# Altium schematic sheet Muller-C2.SchDoc
size 419 x 208 mm
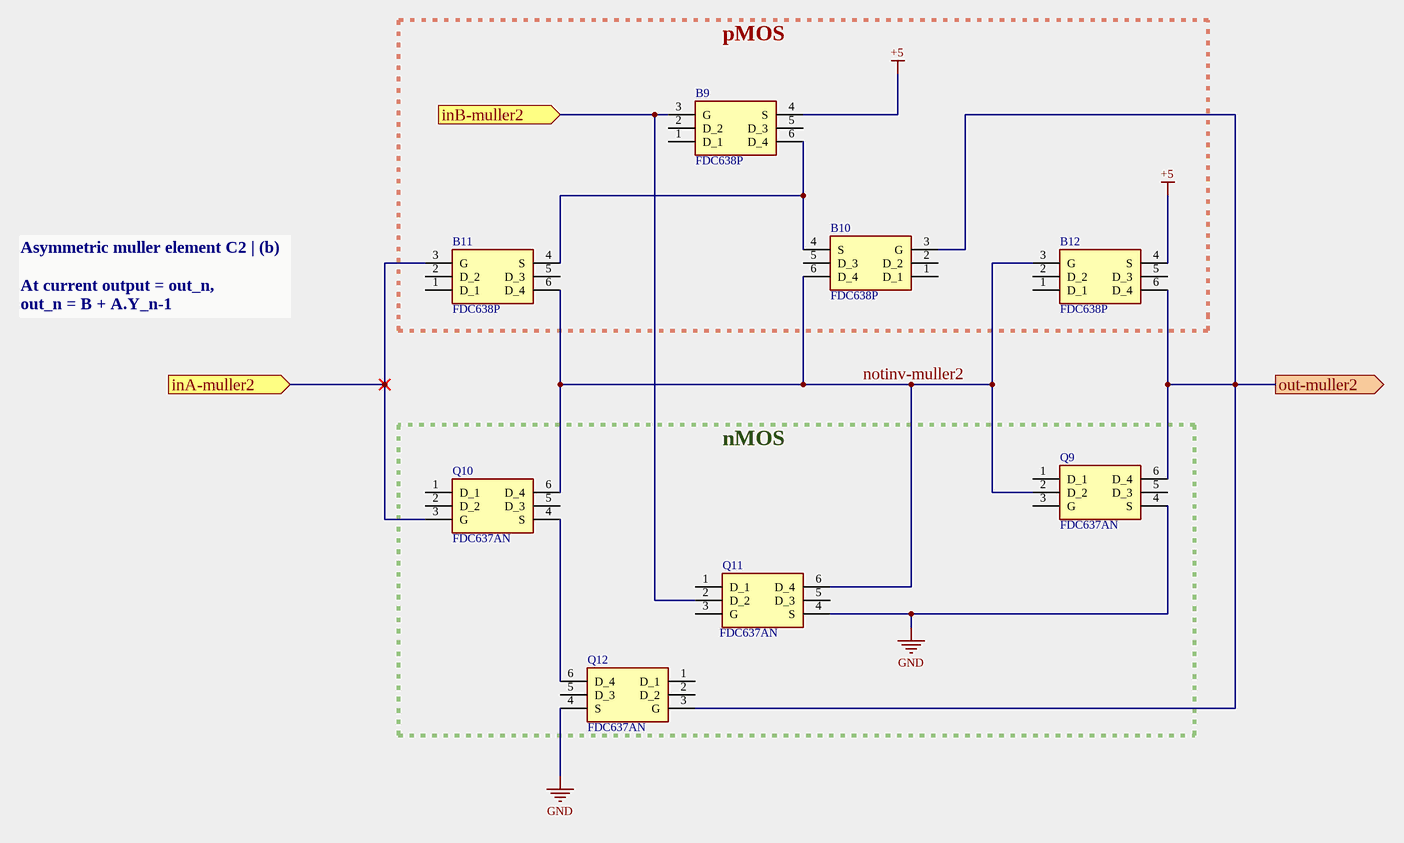
[diagram p0: Muller-C2.SchDoc]

## Parts
B9  FDC638P  [SOT95P275X110-6N]
B10  FDC638P  [SOT95P275X110-6N]
B11  FDC638P  [SOT95P275X110-6N]
B12  FDC638P  [SOT95P275X110-6N]
Q9  FDC637AN  [SOT95P275X110-6N]
Q10  FDC637AN  [SOT95P275X110-6N]
Q11  FDC637AN  [SOT95P275X110-6N]
Q12  FDC637AN  [SOT95P275X110-6N]

## Blocks framed on the sheet
pMOS: B9-B12
nMOS: Q9-Q12

## Ports
inA-muller2 (in), inB-muller2 (in), out-muller2 (out)

## Nets
+5: B9.4(S) B12.4(S)
GND: Q9.4(S) Q11.4(S) Q12.4(S)
inA-muller2: B11.3(G) Q10.3(G) ; port inA-muller2
inB-muller2: B9.3(G) Q11.2(D_2) ; port inB-muller2
notinv-muller2: B10.6(D_4) B11.6(D_4) B12.3(G) Q9.2(D_2) Q10.6(D_4) Q11.6(D_4)
out-muller2: B10.3(G) B12.6(D_4) Q9.6(D_4) Q12.3(G) ; port out-muller2
NetB9_6: B9.6(D_4) B10.4(S) B11.4(S)
NetQ10_4: Q10.4(S) Q12.6(D_4)

Not connected (* = marked no-connect by the designer): B9 1(D_1) 2(D_2) 5(D_3); B10 1(D_1) 2(D_2) 5(D_3); B11 1(D_1) 2(D_2) 5(D_3); B12 1(D_1) 2(D_2) 5(D_3); Q9 1(D_1) 3(G) 5(D_3); Q10 1(D_1) 2(D_2) 5(D_3); Q11 1(D_1) 3(G) 5(D_3); Q12 1(D_1) 2(D_2) 5(D_3)

## Notes on the sheet
- Asymmetric muller element C2 | (b)
  At current output = out_n,
  out_n = B + A.Y_n-1

## Library data of the parts
B9-B12 = CMP-007-000000-1: Low gate charge (10 nC typical); Manufacturer_Name: onsemi; Geometry.Height: 1.1mm; Datasheet Link: https://www.onsemi.com/pub/Collateral/FDC638P-D.PDF; Arrow Price/Stock: *; Design Item ID: FDC638P; Mouser Part Number: 512-FDC638P; Manufacturer_Part_Number: FDC638P; Mouser Price/Stock: https://www.mouser.co.uk/ProductDetail/onsemi-Fairchild/FDC638P?qs=FOlmdCx%252BAA16kOuf%252Brkheg%3D%3D; Source: FDC638P.SchLib; Arrow Part Number: *
Q9-Q12 = CMP-005-000000-4: Low gate charge (10.5nC typical).; Manufacturer_Name: onsemi; Geometry.Height: 1.1mm; Mouser Part Number: 512-FDC637AN; Source: FDC637AN.SchLib; Arrow Part Number: FDC637AN; Datasheet Link: https://www.onsemi.com/pub/Collateral/FDC637AN-D.PDF; Arrow Price/Stock: https://www.arrow.com/en/products/fdc637an/on-semiconductor?region=nac; Manufacturer_Part_Number: FDC637AN; Mouser Price/Stock: https://www.mouser.co.uk/ProductDetail/ON-Semiconductor-Fairchild/FDC637AN?qs=utFvTgNEmG6iAEUdTAueXw%3D%3D; Design Item ID: FDC637AN